# Altium project PCB_Project_2.PrjPcb (part 2 of 4)
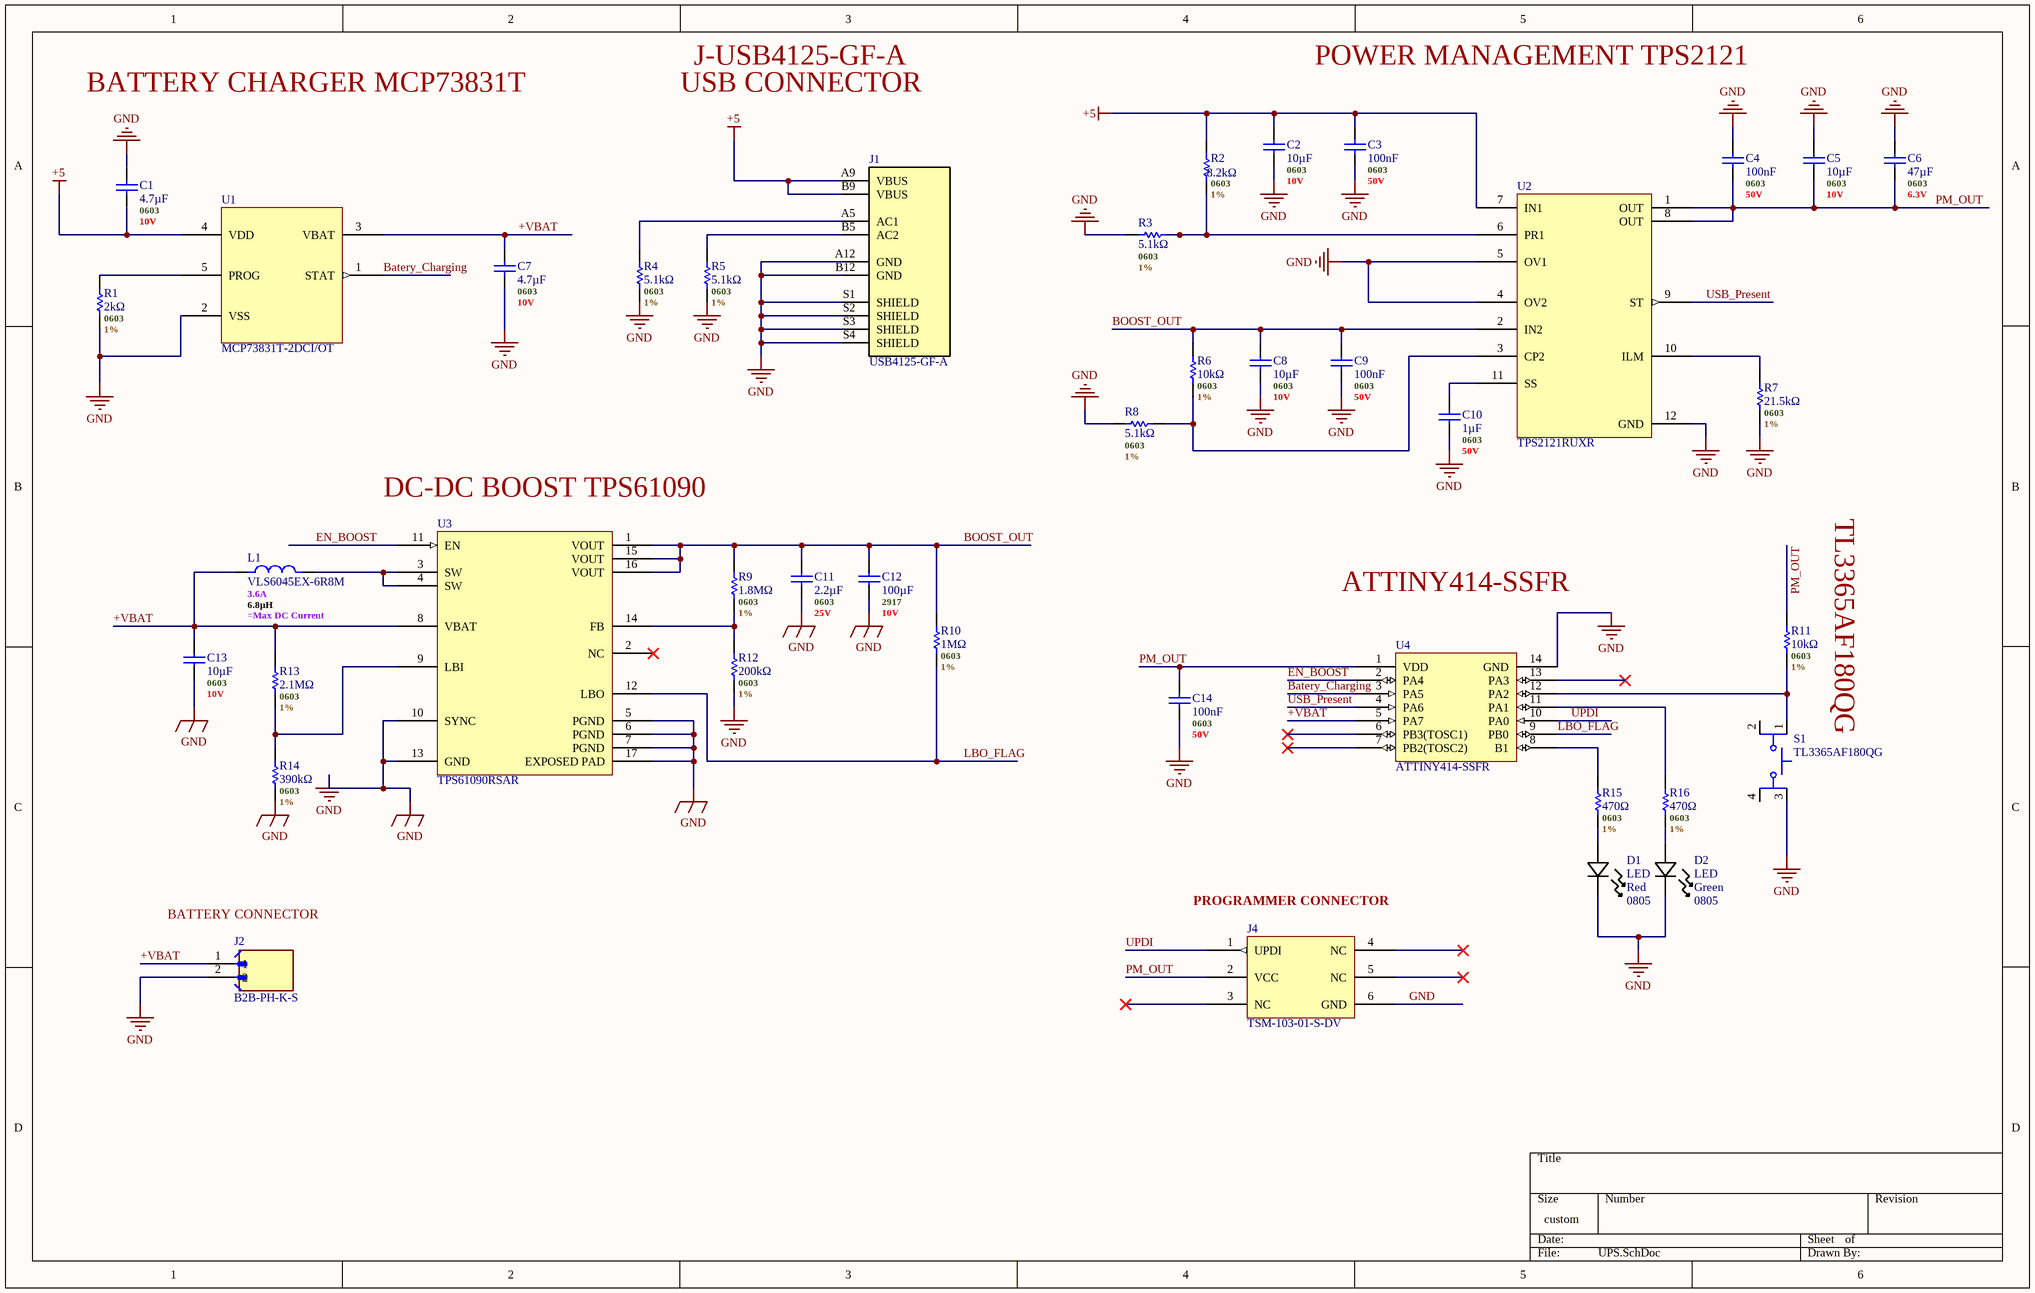
[diagram p1: UPS.SchDoc]

## Sheet UPS.SchDoc (continued)
### Library data of the parts
C1 C7 = CAP - GENERIC: Ceramic Capacitor, Ceramic, 10V, 20% +Tol, 20% -Tol, X7R, 15% TC, 4.7uF, Surface Mount, 0603; Manufacturer: Murata; Manufacturer Part Number: GRM188Z71A475ME15D; Manufacturer Lifecycle Status: IN PRODUCTION; Supplier: DigiKey; Supplier Part Number: 490-GRM188Z71A475ME15DCT-ND; RoHS: Compliant; Category: Ceramic Capacitors; Stock: 107870; Pricing: 1=0,21, 10=0,122, 50=0,0874, 100=0,0768, 500=0,05886, 1000=0,05334 (USD); Value: 4.7µF; Case/Package: 0603; Dielectric Material: Ceramic; Height: 800µm; Length: 1.6mm; Lifecycle Status: Production; Material: Ceramic; Max Operating Temperature: 125°C; Min Operating Temperature: -55°C; Mounting Technology: Surface Mount; Number of Terminals: 2; REACH SVHC: Yes; Thickness: 800µm; Tolerance: 20%; Voltage Rating: 10V; Voltage Rating (DC): 10V; Width: 800µm; ComponentLink1URL: https://datasheet.octopart.com:443/GRM188Z71A475ME15D-Murata-datasheet-149523300.pdf?src-supplier=Newark; ComponentLink1Description: https://datasheet.octopart.com:443/GRM188Z71A475ME15D-Murata-datasheet-149523300.pdf?src-supplier=Newark; ComponentLink2URL: https://datasheet.octopart.com:443/GRM188Z71A475ME15D-Murata-datasheet-141276011.pdf?src-supplier=Geoflip; ComponentLink2Description: https://datasheet.octopart.com:443/GRM188Z71A475ME15D-Murata-datasheet-141276011.pdf?src-supplier=Geoflip; ComponentLink3URL: https://datasheet.octopart.com:443/GRM188Z71A475ME15D-Murata-datasheet-165579666.pdf?src-supplier=TME; ComponentLink3Description: https://datasheet.octopart.com:443/GRM188Z71A475ME15D-Murata-datasheet-165579666.pdf?src-supplier=TME; ComponentLink4URL: https://datasheet.octopart.com:443/GRM188Z71A475ME15D-Murata-datasheet-140705914.pdf?src-supplier=Ciiva; ComponentLink4Description: https://datasheet.octopart.com:443/GRM188Z71A475ME15D-Murata-datasheet-140705914.pdf?src-supplier=Ciiva; ComponentLink5URL: https://datasheet.octopart.com:443/GRM188Z71A475ME15D-Murata-datasheet-138743432.pdf?src-supplier=Ciiva; ComponentLink5Description: https://datasheet.octopart.com:443/GRM188Z71A475ME15D-Murata-datasheet-138743432.pdf?src-supplier=Ciiva; ComponentLink6URL: http://sigma.octopart.com:80/reach_statement/Murata-company-16.pdf?src-supplier=Compliance+Statements; ComponentLink6Description: http://sigma.octopart.com:80/reach_statement/Murata-company-16.pdf?src-supplier=Compliance+Statements; Supplier 1: DigiKey; Supplier Part Number 1: 490-GRM188Z71A475ME15DCT-ND
C2 C5 C8 C13 = CAP - GENERIC: Ceramic Capacitor, Ceramic, 10V, 20% +Tol, 20% -Tol, X5R, 15% TC, 10uF, Surface Mount, 0603; Manufacturer: Murata; Manufacturer Part Number: GRM188R61A106ME69D; Manufacturer Lifecycle Status: IN PRODUCTION; Supplier: DigiKey; Supplier Part Number: 490-10475-1-ND; RoHS: Compliant; Category: Ceramic Capacitors; Stock: 99427; Pricing: 1=0,12, 10=0,067, 50=0,0464, 100=0,0401, 500=0,02974, 1000=0,02654 (USD); Value: 10µF; Case/Package: 0603; Case Code (Imperial): 0603; Case Code (Metric): 1608; Depth: 800µm; Dielectric: X5R; Dielectric Material: Ceramic; Height: 800µm; Lead Free: Lead Free; Length: 1.6mm; Lifecycle Status: Production; Material: Ceramic; Max Operating Temperature: 85°C; Min Operating Temperature: -55°C; Mounting Technology: Surface Mount; Pins: 2; Number of Terminals: 2; REACH SVHC: Yes; Schedule B: 8532240020, 8532240020|8532240020, 8532240020|8532240020|8532240020, 8532240020|8532240020|8532240020|8532240020; Termination: SMD/SMT; Thickness: 800µm; Tolerance: 20%; Voltage Rating: 10V; Voltage Rating (DC): 10V; Weight: 6.293594mg; Width: 800µm; ComponentLink1URL: https://datasheet.octopart.com:443/GRM188R61A106ME69D-Murata-datasheet-32479577.pdf?src-supplier=Upverter; ComponentLink1Description: https://datasheet.octopart.com:443/GRM188R61A106ME69D-Murata-datasheet-32479577.pdf?src-supplier=Upverter; ComponentLink2URL: https://datasheet.octopart.com:443/GRM188R61A106ME69D-Murata-datasheet-34231353.pdf?src-supplier=Newark; ComponentLink2Description: https://datasheet.octopart.com:443/GRM188R61A106ME69D-Murata-datasheet-34231353.pdf?src-supplier=Newark; ComponentLink3URL: https://datasheet.octopart.com:443/GRM188R61A106ME69D-Murata-datasheet-62317187.pdf?src-supplier=element14+APAC; ComponentLink3Description: https://datasheet.octopart.com:443/GRM188R61A106ME69D-Murata-datasheet-62317187.pdf?src-supplier=element14+APAC; ComponentLink4URL: https://datasheet.octopart.com:443/GRM188R61A106ME69D-Murata-datasheet-179080479.pdf?src-supplier=Arrow.cn; ComponentLink4Description: https://datasheet.octopart.com:443/GRM188R61A106ME69D-Murata-datasheet-179080479.pdf?src-supplier=Arrow.cn; ComponentLink5URL: https://datasheet.octopart.com:443/GRM188R61A106ME69D-Murata-datasheet-165579666.pdf?src-supplier=TME; ComponentLink5Description: https://datasheet.octopart.com:443/GRM188R61A106ME69D-Murata-datasheet-165579666.pdf?src-supplier=TME; ComponentLink6URL: https://datasheet.octopart.com:443/GRM188R61A106ME69D-Murata-datasheet-141274968.pdf?src-supplier=Ciiva; ComponentLink6Description: https://datasheet.octopart.com:443/GRM188R61A106ME69D-Murata-datasheet-141274968.pdf?src-supplier=Ciiva; ComponentLink7URL: https://datasheet.octopart.com:443/GRM188R61A106ME69D-Murata-datasheet-140704423.pdf?src-supplier=Ciiva; ComponentLink7Description: https://datasheet.octopart.com:443/GRM188R61A106ME69D-Murata-datasheet-140704423.pdf?src-supplier=Ciiva; ComponentLink8URL: https://datasheet.octopart.com:443/GRM188R61A106ME69D-Murata-datasheet-138742817.pdf?src-supplier=Ciiva; ComponentLink8Description: https://datasheet.octopart.com:443/GRM188R61A106ME69D-Murata-datasheet-138742817.pdf?src-supplier=Ciiva; ComponentLink9URL: https://datasheet.octopart.com:443/GRM188R61A106ME69D-Murata-datasheet-120101189.pdf?src-supplier=Megastar; ComponentLink9Description: https://datasheet.octopart.com:443/GRM188R61A106ME69D-Murata-datasheet-120101189.pdf?src-supplier=Megastar; ComponentLink10URL: https://datasheet.octopart.com:443/GRM188R61A106ME69D-Murata-datasheet-22122223.pdf?src-supplier=Future+Electronics; ComponentLink10Description: https://datasheet.octopart.com:443/GRM188R61A106ME69D-Murata-datasheet-22122223.pdf?src-supplier=Future+Electronics; ComponentLink11URL: https://datasheet.octopart.com/GRM188R61A106ME69D-Murata-datasheet-12515295.pdf; ComponentLink11Description: https://datasheet.octopart.com/GRM188R61A106ME69D-Murata-datasheet-12515295.pdf; ComponentLink12URL: https://datasheet.octopart.com/GRM188R61A106ME69D-Murata-datasheet-12510076.pdf; ComponentLink12Description: https://datasheet.octopart.com/GRM188R61A106ME69D-Murata-datasheet-12510076.pdf; ComponentLink13URL: https://datasheet.octopart.com/GRM188R61A106ME69D-Murata-datasheet-11978611.pdf; ComponentLink13Description: https://datasheet.octopart.com/GRM188R61A106ME69D-Murata-datasheet-11978611.pdf; ComponentLink14URL: https://datasheet.octopart.com/GRM188R61A106ME69D-Murata-datasheet-10025737.pdf; ComponentLink14Description: https://datasheet.octopart.com/GRM188R61A106ME69D-Murata-datasheet-10025737.pdf; ComponentLink15URL: https://datasheet.octopart.com/GRM188R61A106ME69D-Murata-datasheet-8819587.pdf; ComponentLink15Description: https://datasheet.octopart.com/GRM188R61A106ME69D-Murata-datasheet-8819587.pdf; ComponentLink16URL: https://datasheet.octopart.com/GRM188R61A106ME69D-Murata-datasheet-14401046.pdf; ComponentLink16Description: https://datasheet.octopart.com/GRM188R61A106ME69D-Murata-datasheet-14401046.pdf; ComponentLink17URL: http://sigma.octopart.com:80/reach_statement/Murata-company-16.pdf?src-supplier=Compliance+Statements; ComponentLink17Description: http://sigma.octopart.com:80/reach_statement/Murata-company-16.pdf?src-supplier=Compliance+Statements; Supplier 1: DigiKey; Supplier Part Number 1: 490-10475-1-ND
C3 C4 C9 C14 = CAP - GENERIC: Cap Ceramic 0.1uF 50V X7R 10% Pad SMD 0603 Soft Termination 125C Automotive T/R; Manufacturer: Murata; Manufacturer Part Number: GCJ188R71H104KA12D; Manufacturer Lifecycle Status: IN PRODUCTION; Supplier: DigiKey; Supplier Part Number: 490-5798-1-ND; RoHS: Compliant; Category: Ceramic Capacitors; Stock: 2272752; Pricing: 1=0,13, 10=0,072, 50=0,05, 100=0,0434, 500=0,0323, 1000=0,02889 (USD); Value: 100nF; Case/Package: 0603; Case Code (Imperial): 0603; Case Code (Metric): 1608; Depth: 800µm; Dielectric: X7R; Dielectric Material: Ceramic; Features: Soft Termination; Height: 800µm; Lead Free: Lead Free; Length: 1.6mm; Lifecycle Status: Production; Material: Ceramic; Max Operating Temperature: 125°C; Min Operating Temperature: -55°C; Mounting Technology: Surface Mount; Number of Terminals: 2; Packaging: Cut Tape; Radiation Hardening: No; Ratings: AEC-Q200; REACH SVHC: Yes; Schedule B: 8532240020, 8532240020|8532240020, 8532240020|8532240020|8532240020, 8532240020|8532240020|8532240020|8532240020; Termination: SMD/SMT; Tolerance: 10%; Voltage Rating: 50V; Voltage Rating (DC): 50V; Width: 800µm; ComponentLink1URL: https://datasheet.octopart.com:443/GCJ188R71H104KA12D-Murata-datasheet-68586835.pdf?src-supplier=Newark; ComponentLink1Description: https://datasheet.octopart.com:443/GCJ188R71H104KA12D-Murata-datasheet-68586835.pdf?src-supplier=Newark; ComponentLink2URL: https://datasheet.octopart.com:443/GCJ188R71H104KA12D-Murata-datasheet-140654765.pdf?src-supplier=Ciiva; ComponentLink2Description: https://datasheet.octopart.com:443/GCJ188R71H104KA12D-Murata-datasheet-140654765.pdf?src-supplier=Ciiva; ComponentLink3URL: https://datasheet.octopart.com:443/GCJ188R71H104KA12D-Murata-datasheet-138714437.pdf?src-supplier=Ciiva; ComponentLink3Description: https://datasheet.octopart.com:443/GCJ188R71H104KA12D-Murata-datasheet-138714437.pdf?src-supplier=Ciiva; ComponentLink4URL: https://datasheet.octopart.com:443/GCJ188R71H104KA12D-Murata-datasheet-165611796.pdf?src-supplier=TME; ComponentLink4Description: https://datasheet.octopart.com:443/GCJ188R71H104KA12D-Murata-datasheet-165611796.pdf?src-supplier=TME; ComponentLink5URL: https://datasheet.octopart.com:443/GCJ188R71H104KA12D-Murata-datasheet-12524712.pdf?src-supplier=Future+Electronics; ComponentLink5Description: https://datasheet.octopart.com:443/GCJ188R71H104KA12D-Murata-datasheet-12524712.pdf?src-supplier=Future+Electronics; ComponentLink6URL: https://datasheet.octopart.com/GCJ188R71H104KA12D-Murata-datasheet-14405607.pdf; ComponentLink6Description: https://datasheet.octopart.com/GCJ188R71H104KA12D-Murata-datasheet-14405607.pdf; ComponentLink7URL: http://sigma.octopart.com:80/reach_statement/Murata-company-16.pdf?src-supplier=Compliance+Statements; ComponentLink7Description: http://sigma.octopart.com:80/reach_statement/Murata-company-16.pdf?src-supplier=Compliance+Statements; Supplier 1: DigiKey; Supplier Part Number 1: 490-5798-1-ND
C6 = CAP - GENERIC: 6.3V 47uF X5R ±20% 0603 Multilayer Ceramic Capacitors MLCC - SMD/SMT ROHS; Manufacturer: Murata; Manufacturer Part Number: GRM188R60J476ME15D; Manufacturer Lifecycle Status: IN PRODUCTION; Supplier: DigiKey; Supplier Part Number: 490-13247-1-ND; RoHS: Compliant; Category: Ceramic Capacitors; Stock: 2045995; Pricing: 1=0,21, 10=0,11 (USD); Value: 47µF; Case/Package: 0603; Case Code (Imperial): 0603; Case Code (Metric): 1608; Dielectric: X5R; Dielectric Material: Ceramic; Height: 800µm; Length: 1.6mm; Lifecycle Status: Production; Material: Ceramic; Max Operating Temperature: 85°C; Min Operating Temperature: -55°C; Mounting Technology: Surface Mount; Number of Terminals: 2; REACH SVHC: Yes; Schedule B: 8532240020, 8532240020|8532240020|8532240020|8532240020|8532240020|8532240020|8532240020|8532240020|8532240020|8532240020|8532240020|8532240020|8532240020|8532240020|8532240020|8532240020|8532240020|8532240020|8532240020|8532240020|8532240020|8532240020|8532240020|85; Thickness: 800µm; Tolerance: 20%; Voltage Rating: 6.3V; Voltage Rating (DC): 6.3V; Width: 800µm; ComponentLink1URL: https://datasheet.octopart.com:443/GRM188R60J476ME15D-Murata-datasheet-149523200.pdf?src-supplier=Newark; ComponentLink1Description: https://datasheet.octopart.com:443/GRM188R60J476ME15D-Murata-datasheet-149523200.pdf?src-supplier=Newark; ComponentLink2URL: https://datasheet.octopart.com:443/GRM188R60J476ME15D-Murata-datasheet-165579666.pdf?src-supplier=TME; ComponentLink2Description: https://datasheet.octopart.com:443/GRM188R60J476ME15D-Murata-datasheet-165579666.pdf?src-supplier=TME; ComponentLink3URL: https://datasheet.octopart.com:443/GRM188R60J476ME15D-Murata-datasheet-141274968.pdf?src-supplier=Ciiva; ComponentLink3Description: https://datasheet.octopart.com:443/GRM188R60J476ME15D-Murata-datasheet-141274968.pdf?src-supplier=Ciiva; ComponentLink4URL: https://datasheet.octopart.com:443/GRM188R60J476ME15D-Murata-datasheet-140704401.pdf?src-supplier=Ciiva; ComponentLink4Description: https://datasheet.octopart.com:443/GRM188R60J476ME15D-Murata-datasheet-140704401.pdf?src-supplier=Ciiva; ComponentLink5URL: https://datasheet.octopart.com:443/GRM188R60J476ME15D-Murata-datasheet-138742802.pdf?src-supplier=Ciiva; ComponentLink5Description: https://datasheet.octopart.com:443/GRM188R60J476ME15D-Murata-datasheet-138742802.pdf?src-supplier=Ciiva; ComponentLink6URL: https://datasheet.octopart.com:443/GRM188R60J476ME15D-Murata-datasheet-102370999.pdf?src-supplier=Future+Electronics; ComponentLink6Description: https://datasheet.octopart.com:443/GRM188R60J476ME15D-Murata-datasheet-102370999.pdf?src-supplier=Future+Electronics; ComponentLink7URL: https://datasheet.octopart.com/GRM188R60J476ME15D-Murata-datasheet-12515295.pdf; ComponentLink7Description: https://datasheet.octopart.com/GRM188R60J476ME15D-Murata-datasheet-12515295.pdf; ComponentLink8URL: https://datasheet.octopart.com/GRM188R60J476ME15D-Murata-datasheet-12510076.pdf; ComponentLink8Description: https://datasheet.octopart.com/GRM188R60J476ME15D-Murata-datasheet-12510076.pdf; ComponentLink9URL: https://datasheet.octopart.com/GRM188R60J476ME15D-Murata-datasheet-11978611.pdf; ComponentLink9Description: https://datasheet.octopart.com/GRM188R60J476ME15D-Murata-datasheet-11978611.pdf; ComponentLink10URL: https://datasheet.octopart.com/GRM188R60J476ME15D-Murata-datasheet-10025737.pdf; ComponentLink10Description: https://datasheet.octopart.com/GRM188R60J476ME15D-Murata-datasheet-10025737.pdf; ComponentLink11URL: https://datasheet.octopart.com/GRM188R60J476ME15D-Murata-datasheet-8819587.pdf; ComponentLink11Description: https://datasheet.octopart.com/GRM188R60J476ME15D-Murata-datasheet-8819587.pdf; ComponentLink12URL: http://sigma.octopart.com:80/reach_statement/Murata-company-16.pdf?src-supplier=Compliance+Statements; ComponentLink12Description: http://sigma.octopart.com:80/reach_statement/Murata-company-16.pdf?src-supplier=Compliance+Statements; Supplier 1: DigiKey; Supplier Part Number 1: 490-13247-1-ND
C10 = CAP - GENERIC: Multilayer Ceramic Capacitors MLCC - SMD/SMT 0603 50Vdc 1.0uF X5R 10%; Manufacturer: Murata; Manufacturer Part Number: GRT188R61H105KE13D; Manufacturer Lifecycle Status: IN PRODUCTION; Supplier: DigiKey; Supplier Part Number: 490-12330-1-ND; RoHS: Compliant; Category: Ceramic Capacitors; Stock: 586495; Pricing: 1=0,14, 10=0,078, 50=0,0546, 100=0,0475, 500=0,0355, 1000=0,03182 (USD); Value: 1µF; Case/Package: 0603; Case Code (Imperial): 0603; Case Code (Metric): 1608; Dielectric: X5R; Dielectric Material: Ceramic; Height: 800µm; Length: 1.6mm; Lifecycle Status: Production; Material: Ceramic; Max Operating Temperature: 85°C; Min Operating Temperature: -55°C; Mounting Technology: Surface Mount; Number of Terminals: 2; Packaging: Cut Tape; Ratings: AEC-Q200; REACH SVHC: Yes; Schedule B: 8532240020, 8532240020|8532240020, 8532240020|8532240020|8532240020, 8532240020|8532240020|8532240020|8532240020; Tolerance: 10%; Voltage Rating: 50V; Voltage Rating (DC): 50V; Width: 800µm; ComponentLink1URL: https://datasheet.octopart.com:443/GRT188R61H105KE13D-Murata-datasheet-67697751.pdf?src-supplier=Newark; ComponentLink1Description: https://datasheet.octopart.com:443/GRT188R61H105KE13D-Murata-datasheet-67697751.pdf?src-supplier=Newark; ComponentLink2URL: https://datasheet.octopart.com:443/GRT188R61H105KE13D-Murata-datasheet-149523596.pdf?src-supplier=Newark; ComponentLink2Description: https://datasheet.octopart.com:443/GRT188R61H105KE13D-Murata-datasheet-149523596.pdf?src-supplier=Newark; ComponentLink3URL: https://datasheet.octopart.com:443/GRT188R61H105KE13D-Murata-datasheet-141284650.pdf?src-supplier=Geoflip; ComponentLink3Description: https://datasheet.octopart.com:443/GRT188R61H105KE13D-Murata-datasheet-141284650.pdf?src-supplier=Geoflip; ComponentLink4URL: https://datasheet.octopart.com:443/GRT188R61H105KE13D-Murata-datasheet-165579666.pdf?src-supplier=TME; ComponentLink4Description: https://datasheet.octopart.com:443/GRT188R61H105KE13D-Murata-datasheet-165579666.pdf?src-supplier=TME; ComponentLink5URL: https://datasheet.octopart.com:443/GRT188R61H105KE13D-Murata-datasheet-140711328.pdf?src-supplier=Ciiva; ComponentLink5Description: https://datasheet.octopart.com:443/GRT188R61H105KE13D-Murata-datasheet-140711328.pdf?src-supplier=Ciiva; ComponentLink6URL: https://datasheet.octopart.com:443/GRT188R61H105KE13D-Murata-datasheet-138749128.pdf?src-supplier=Ciiva; ComponentLink6Description: https://datasheet.octopart.com:443/GRT188R61H105KE13D-Murata-datasheet-138749128.pdf?src-supplier=Ciiva; ComponentLink7URL: http://sigma.octopart.com:80/reach_statement/Murata-company-16.pdf?src-supplier=Compliance+Statements; ComponentLink7Description: http://sigma.octopart.com:80/reach_statement/Murata-company-16.pdf?src-supplier=Compliance+Statements; Supplier 1: DigiKey; Supplier Part Number 1: 490-12330-1-ND
C11 = CAP - GENERIC: Ceramic Capacitor, Ceramic, 25V, 10% +Tol, 10% -Tol, X5R, 15% TC, 2.2uF, Surface Mount, 0603; Manufacturer: Murata; Manufacturer Part Number: GRM188R61E225KA12D; Manufacturer Lifecycle Status: IN PRODUCTION; Supplier: DigiKey; Supplier Part Number: 490-10731-1-ND; RoHS: Compliant; Category: Ceramic Capacitors; Stock: 188068; Pricing: 1=0,1, 10=0,052, 50=0,0356, 100=0,0307, 500=0,02244, 1000=0,01991 (USD); Value: 2.2µF; Case/Package: 0603; Case Code (Imperial): 0603; Case Code (Metric): 1608; Composition: Ceramic; Depth: 800µm; Dielectric: X5R; Dielectric Material: Ceramic; Height: 800µm; Lead Free: Lead Free; Length: 1.6mm; Lifecycle Status: Production; Material: Ceramic; Max Operating Temperature: 85°C; Min Operating Temperature: -55°C; Mounting Technology: Surface Mount; Pins: 2; Number of Terminals: 2; Packaging: Cut Tape; Radiation Hardening: No; REACH SVHC: Yes; Schedule B: 8532240020, 8532240020|8532240020, 8532240020|8532240020|8532240020, 8532240020|8532240020|8532240020|8532240020; Termination: SMD/SMT; Thickness: 800µm; Tolerance: 10%; Voltage: 25V; Voltage Rating: 25V; Voltage Rating (DC): 25V; Weight: 6.293594mg; Width: 800µm; ComponentLink1URL: https://datasheet.octopart.com:443/GRM188R61E225KA12D-Murata-datasheet-62317198.pdf?src-supplier=element14+APAC; ComponentLink1Description: https://datasheet.octopart.com:443/GRM188R61E225KA12D-Murata-datasheet-62317198.pdf?src-supplier=element14+APAC; ComponentLink2URL: https://datasheet.octopart.com:443/GRM188R61E225KA12D-Murata-datasheet-17853099.pdf?src-supplier=element14+APAC; ComponentLink2Description: https://datasheet.octopart.com:443/GRM188R61E225KA12D-Murata-datasheet-17853099.pdf?src-supplier=element14+APAC; ComponentLink3URL: https://datasheet.octopart.com/GRM188R61E225KA12D-Murata-datasheet-12515295.pdf; ComponentLink3Description: https://datasheet.octopart.com/GRM188R61E225KA12D-Murata-datasheet-12515295.pdf; ComponentLink4URL: https://datasheet.octopart.com/GRM188R61E225KA12D-Murata-datasheet-12510076.pdf; ComponentLink4Description: https://datasheet.octopart.com/GRM188R61E225KA12D-Murata-datasheet-12510076.pdf; ComponentLink5URL: https://datasheet.octopart.com/GRM188R61E225KA12D-Murata-datasheet-11978611.pdf; ComponentLink5Description: https://datasheet.octopart.com/GRM188R61E225KA12D-Murata-datasheet-11978611.pdf; ComponentLink6URL: https://datasheet.octopart.com/GRM188R61E225KA12D-Murata-datasheet-10025737.pdf; ComponentLink6Description: https://datasheet.octopart.com/GRM188R61E225KA12D-Murata-datasheet-10025737.pdf; ComponentLink7URL: https://datasheet.octopart.com/GRM188R61E225KA12D-Murata-datasheet-8819587.pdf; ComponentLink7Description: https://datasheet.octopart.com/GRM188R61E225KA12D-Murata-datasheet-8819587.pdf; ComponentLink8URL: https://datasheet.octopart.com/GRM188R61E225KA12D-Murata-datasheet-14397280.pdf; ComponentLink8Description: https://datasheet.octopart.com/GRM188R61E225KA12D-Murata-datasheet-14397280.pdf; ComponentLink9URL: https://datasheet.octopart.com:443/GRM188R61E225KA12D-Murata-datasheet-165579666.pdf?src-supplier=TME; ComponentLink9Description: https://datasheet.octopart.com:443/GRM188R61E225KA12D-Murata-datasheet-165579666.pdf?src-supplier=TME; ComponentLink10URL: https://datasheet.octopart.com:443/GRM188R61E225KA12D-Murata-datasheet-141274968.pdf?src-supplier=Ciiva; ComponentLink10Description: https://datasheet.octopart.com:443/GRM188R61E225KA12D-Murata-datasheet-141274968.pdf?src-supplier=Ciiva; ComponentLink11URL: https://datasheet.octopart.com:443/GRM188R61E225KA12D-Murata-datasheet-140705128.pdf?src-supplier=Ciiva; ComponentLink11Description: https://datasheet.octopart.com:443/GRM188R61E225KA12D-Murata-datasheet-140705128.pdf?src-supplier=Ciiva; ComponentLink12URL: https://datasheet.octopart.com:443/GRM188R61E225KA12D-Murata-datasheet-138742892.pdf?src-supplier=Ciiva; ComponentLink12Description: https://datasheet.octopart.com:443/GRM188R61E225KA12D-Murata-datasheet-138742892.pdf?src-supplier=Ciiva; ComponentLink13URL: https://datasheet.octopart.com:443/GRM188R61E225KA12D-Murata-datasheet-22122223.pdf?src-supplier=Future+Electronics; ComponentLink13Description: https://datasheet.octopart.com:443/GRM188R61E225KA12D-Murata-datasheet-22122223.pdf?src-supplier=Future+Electronics; ComponentLink14URL: https://datasheet.octopart.com:443/GRM188R61E225KA12D-Murata-datasheet-8817987.pdf?src-supplier=Newark; ComponentLink14Description: https://datasheet.octopart.com:443/GRM188R61E225KA12D-Murata-datasheet-8817987.pdf?src-supplier=Newark; ComponentLink15URL: http://sigma.octopart.com:80/reach_statement/Murata-company-16.pdf?src-supplier=Compliance+Statements; ComponentLink15Description: http://sigma.octopart.com:80/reach_statement/Murata-company-16.pdf?src-supplier=Compliance+Statements; Supplier 1: DigiKey; Supplier Part Number 1: 490-10731-1-ND
C12 = CAP - GENERIC: Cap Tant Solid 100uF 10V D CASE 20% (7.3 X 4.3 X 2.9mm) SMD 7343-31 0.08 Ohm 125AHA T/R; Manufacturer: KYOCERA AVX; Manufacturer Part Number: TPSD107M010R0080; Approvals: IEC; Dielectric Material: Tantalum; Dissipation Factor: 6%; ESR (Equivalent Series Resistance): 80mΩ; Leakage Current: 10µA; Polarity: Polar; Ripple Current: 548mA; Supplier: DigiKey; Supplier Part Number: 478-4097-1-ND; RoHS: Compliant; Category: Tantalum Capacitors; Stock: 1449; Pricing: 1=1,63, 10=1,083, 50=0,8666, 100=0,7998 (USD); Value: 100µF; Case/Package: 2917; Case Code (Imperial): 2917; Case Code (Metric): 7343; China RoHS: Compliant; Depth: 4.3mm; Features: General Purpose; Height: 2.9mm; Height - Seated (Max): 3.0988mm; Lead Free: Lead Free; Lead Pitch: 4.4mm; Length: 7.3mm; Lifecycle Status: Production; Max Operating Temperature: 125°C; Min Operating Temperature: -55°C; Mounting Technology: Surface Mount; Pins: 2; Number of Terminals: 2; Radiation Hardening: No; REACH SVHC: Yes; Schedule B: 8532210050; Termination: SMD/SMT; Tolerance: 20%; Voltage: 10V; Voltage Rating: 10V; Voltage Rating (DC): 10V; Width: 4.3mm; ComponentLink1URL: https://datasheet.octopart.com:443/TPSD107M010R0080-KYOCERA-AVX-datasheet-170667337.pdf?src-supplier=IHS; ComponentLink1Description: https://datasheet.octopart.com:443/TPSD107M010R0080-KYOCERA-AVX-datasheet-170667337.pdf?src-supplier=IHS; ComponentLink2URL: https://datasheet.octopart.com:443/TPSD107M010R0080-AVX-datasheet-12510848.pdf?src-supplier=Newark; ComponentLink2Description: https://datasheet.octopart.com:443/TPSD107M010R0080-AVX-datasheet-12510848.pdf?src-supplier=Newark; ComponentLink3URL: https://datasheet.octopart.com:443/TPSD107M010R0080-AVX-datasheet-8360139.pdf?src-supplier=Newark; ComponentLink3Description: https://datasheet.octopart.com:443/TPSD107M010R0080-AVX-datasheet-8360139.pdf?src-supplier=Newark; ComponentLink4URL: https://datasheet.octopart.com:443/TPSD107M010R0080-AVX-datasheet-8324186.pdf?src-supplier=Newark; ComponentLink4Description: https://datasheet.octopart.com:443/TPSD107M010R0080-AVX-datasheet-8324186.pdf?src-supplier=Newark; ComponentLink5URL: https://datasheet.octopart.com:443/TPSD107M010R0080-AVX-datasheet-27202918.pdf?src-supplier=Newark; ComponentLink5Description: https://datasheet.octopart.com:443/TPSD107M010R0080-AVX-datasheet-27202918.pdf?src-supplier=Newark; ComponentLink6URL: https://datasheet.octopart.com:443/TPSD107M010R0080-AVX-datasheet-10076061.pdf?src-supplier=Future+Electronics; ComponentLink6Description: https://datasheet.octopart.com:443/TPSD107M010R0080-AVX-datasheet-10076061.pdf?src-supplier=Future+Electronics; ComponentLink7URL: https://datasheet.octopart.com:443/TPSD107M010R0080-AVX-datasheet-10290340.pdf?src-supplier=Future+Electronics; ComponentLink7Description: https://datasheet.octopart.com:443/TPSD107M010R0080-AVX-datasheet-10290340.pdf?src-supplier=Future+Electronics; ComponentLink8URL: https://datasheet.octopart.com:443/TPSD107M010R0080-AVX-datasheet-8878329.pdf?src-supplier=Future+Electronics; ComponentLink8Description: https://datasheet.octopart.com:443/TPSD107M010R0080-AVX-datasheet-8878329.pdf?src-supplier=Future+Electronics; ComponentLink9URL: https://datasheet.octopart.com:443/TPSD107M010R0080-AVX-datasheet-8858609.pdf?src-supplier=Future+Electronics; ComponentLink9Description: https://datasheet.octopart.com:443/TPSD107M010R0080-AVX-datasheet-8858609.pdf?src-supplier=Future+Electronics; ComponentLink10URL: https://datasheet.octopart.com:443/TPSD107M010R0080-AVX-datasheet-8837929.pdf?src-supplier=Future+Electronics; ComponentLink10Description: https://datasheet.octopart.com:443/TPSD107M010R0080-AVX-datasheet-8837929.pdf?src-supplier=Future+Electronics; ComponentLink11URL: https://datasheet.octopart.com:443/TPSD107M010R0080-AVX-datasheet-8725229.pdf?src-supplier=Future+Electronics; ComponentLink11Description: https://datasheet.octopart.com:443/TPSD107M010R0080-AVX-datasheet-8725229.pdf?src-supplier=Future+Electronics; ComponentLink12URL: https://datasheet.octopart.com:443/TPSD107M010R0080-AVX-datasheet-8700837.pdf?src-supplier=Future+Electronics; ComponentLink12Description: https://datasheet.octopart.com:443/TPSD107M010R0080-AVX-datasheet-8700837.pdf?src-supplier=Future+Electronics; ComponentLink13URL: https://datasheet.octopart.com:443/TPSD107M010R0080-AVX-datasheet-8619349.pdf?src-supplier=Future+Electronics; ComponentLink13Description: https://datasheet.octopart.com:443/TPSD107M010R0080-AVX-datasheet-8619349.pdf?src-supplier=Future+Electronics; ComponentLink14URL: https://datasheet.octopart.com:443/TPSD107M010R0080-AVX-datasheet-8446044.pdf?src-supplier=Future+Electronics; ComponentLink14Description: https://datasheet.octopart.com:443/TPSD107M010R0080-AVX-datasheet-8446044.pdf?src-supplier=Future+Electronics; ComponentLink15URL: https://datasheet.octopart.com:443/TPSD107M010R0080-AVX-datasheet-7831437.pdf?src-supplier=Future+Electronics; ComponentLink15Description: https://datasheet.octopart.com:443/TPSD107M010R0080-AVX-datasheet-7831437.pdf?src-supplier=Future+Electronics; ComponentLink16URL: https://datasheet.octopart.com:443/TPSD107M010R0080-AVX-datasheet-7558262.pdf?src-supplier=Future+Electronics; ComponentLink16Description: https://datasheet.octopart.com:443/TPSD107M010R0080-AVX-datasheet-7558262.pdf?src-supplier=Future+Electronics; ComponentLink17URL: https://datasheet.octopart.com:443/TPSD107M010R0080-AVX-datasheet-5394076.pdf?src-supplier=Future+Electronics; ComponentLink17Description: https://datasheet.octopart.com:443/TPSD107M010R0080-AVX-datasheet-5394076.pdf?src-supplier=Future+Electronics; ComponentLink18URL: https://datasheet.octopart.com:443/TPSD107M010R0080-AVX-datasheet-5306713.pdf?src-supplier=Future+Electronics; ComponentLink18Description: https://datasheet.octopart.com:443/TPSD107M010R0080-AVX-datasheet-5306713.pdf?src-supplier=Future+Electronics; ComponentLink19URL: https://datasheet.octopart.com:443/TPSD107M010R0080-AVX-datasheet-554398.pdf?src-supplier=Future+Electronics; ComponentLink19Description: https://datasheet.octopart.com:443/TPSD107M010R0080-AVX-datasheet-554398.pdf?src-supplier=Future+Electronics; ComponentLink20URL: https://datasheet.octopart.com:443/TPSD107M010R0080-KYOCERA-AVX-datasheet-103254538.pdf?src-supplier=element14+APAC; ComponentLink20Description: https://datasheet.octopart.com:443/TPSD107M010R0080-KYOCERA-AVX-datasheet-103254538.pdf?src-supplier=element14+APAC; ComponentLink21URL: https://datasheet.octopart.com:443/TPSD107M010R0080-AVX-datasheet-65931755.pdf?src-supplier=Farnell; ComponentLink21Description: https://datasheet.octopart.com:443/TPSD107M010R0080-AVX-datasheet-65931755.pdf?src-supplier=Farnell; ComponentLink22URL: https://datasheet.octopart.com:443/TPSD107M010R0080-KYOCERA-AVX-datasheet-50869160.pdf?src-supplier=AVX; ComponentLink22Description: https://datasheet.octopart.com:443/TPSD107M010R0080-KYOCERA-AVX-datasheet-50869160.pdf?src-supplier=AVX; ComponentLink23URL: https://datasheet.octopart.com:443/TPSD107M010R0080-KYOCERA-AVX-datasheet-156093879.pdf?src-supplier=TME; ComponentLink23Description: https://datasheet.octopart.com:443/TPSD107M010R0080-KYOCERA-AVX-datasheet-156093879.pdf?src-supplier=TME; ComponentLink24URL: https://datasheet.octopart.com/TPS-Series---Standard-Tantalum-AVX-datasheet-family-190.pdf; ComponentLink24Description: https://datasheet.octopart.com/TPS-Series---Standard-Tantalum-AVX-datasheet-family-190.pdf; ComponentLink25URL: https://datasheet.octopart.com/TPSD107M010R0080-AVX---Kyocera-datasheet-12511273.pdf; ComponentLink25Description: https://datasheet.octopart.com/TPSD107M010R0080-AVX---Kyocera-datasheet-12511273.pdf; ComponentLink26URL: https://datasheet.octopart.com/TPSD107M010R0080-AVX---Kyocera-datasheet-8398506.pdf; ComponentLink26Description: https://datasheet.octopart.com/TPSD107M010R0080-AVX---Kyocera-datasheet-8398506.pdf; ComponentLink27URL: https://datasheet.octopart.com/TPSD107M010R0080-AVX---Kyocera-datasheet-8359467.pdf; ComponentLink27Description: https://datasheet.octopart.com/TPSD107M010R0080-AVX---Kyocera-datasheet-8359467.pdf; ComponentLink28URL: https://datasheet.octopart.com:443/TPSD107M010R0080-AVX-datasheet-37470795.pdf?src-supplier=RS+(Formerly+Allied+Electronics); ComponentLink28Description: https://datasheet.octopart.com:443/TPSD107M010R0080-AVX-datasheet-37470795.pdf?src-supplier=RS+(Formerly+Allied+Electronics); ComponentLink29URL: https://datasheet.octopart.com:443/TPSD107M010R0080-AVX-datasheet-10394.pdf?src-supplier=RS+(Formerly+Allied+Electronics); ComponentLink29Description: https://datasheet.octopart.com:443/TPSD107M010R0080-AVX-datasheet-10394.pdf?src-supplier=RS+(Formerly+Allied+Electronics); ComponentLink30URL: https://datasheet.octopart.com:443/TPSD107M010R0080-AVX-datasheet-30272.pdf?src-supplier=RS+(Formerly+Allied+Electronics); ComponentLink30Description: https://datasheet.octopart.com:443/TPSD107M010R0080-AVX-datasheet-30272.pdf?src-supplier=RS+(Formerly+Allied+Electronics); ComponentLink31URL: https://datasheet.octopart.com:443/TPSD107M010R0080-AVX-datasheet-13379207.pdf?src-supplier=_legacy+Avnet; ComponentLink31Description: https://datasheet.octopart.com:443/TPSD107M010R0080-AVX-datasheet-13379207.pdf?src-supplier=_legacy+Avnet; ComponentLink32URL: https://datasheet.octopart.com:443/TPSD107M010R0080-AVX-datasheet-8398416.pdf?src-supplier=_legacy+Avnet; ComponentLink32Description: https://datasheet.octopart.com:443/TPSD107M010R0080-AVX-datasheet-8398416.pdf?src-supplier=_legacy+Avnet; ComponentLink33URL: https://datasheet.octopart.com:443/TPSD107M010R0080-AVX-datasheet-8372916.pdf?src-supplier=_legacy+Avnet; ComponentLink33Description: https://datasheet.octopart.com:443/TPSD107M010R0080-AVX-datasheet-8372916.pdf?src-supplier=_legacy+Avnet; ComponentLink34URL: https://datasheet.octopart.com:443/TPSD107M010R0080-AVX-datasheet-5333682.pdf?src-supplier=_legacy+Avnet; ComponentLink34Description: https://datasheet.octopart.com:443/TPSD107M010R0080-AVX-datasheet-5333682.pdf?src-supplier=_legacy+Avnet; ComponentLink35URL: https://datasheet.octopart.com:443/TPSD107M010R0080-AVX-datasheet-11541637.pdf?src-supplier=Arrow+Electronics; ComponentLink35Description: https://datasheet.octopart.com:443/TPSD107M010R0080-AVX-datasheet-11541637.pdf?src-supplier=Arrow+Electronics; ComponentLink36URL: https://datasheet.octopart.com:443/TPSD107M010R0080-AVX-datasheet-118643.pdf?src-supplier=DigiKey; ComponentLink36Description: https://datasheet.octopart.com:443/TPSD107M010R0080-AVX-datasheet-118643.pdf?src-supplier=DigiKey; ComponentLink37URL: http://sigma.octopart.com:80/reach_statement/AVX-company-19.pdf?src-supplier=Compliance+Statements; ComponentLink37Description: http://sigma.octopart.com:80/reach_statement/AVX-company-19.pdf?src-supplier=Compliance+Statements; ComponentLink38URL: http://sigma.octopart.com:80/conflict_mineral_statement/AVX-company-34.pdf?src-supplier=Compliance+Statements; ComponentLink38Description: http://sigma.octopart.com:80/conflict_mineral_statement/AVX-company-34.pdf?src-supplier=Compliance+Statements; Supplier 1: DigiKey; Supplier Part Number 1: 478-4097-1-ND
D1 = LED: Single-color LEDs; LITEON; LTST-C170KRKT; Red; 130 °; 2 V; 0805; Manufacturer: Lite-On; Dominant Wavelength: 631nm; Forward Current: 30mA; Forward Voltage: 2.4V; Lens Color: Clear, Colorless; Lens Style: Clear; Luminous Intensity: 18mcd; Number of Circuits: 1; Peak Wavelength: 639nm; Power Dissipation: 75mW; Reverse Voltage: 5V; Shape: Rectangular; Test Current: 20mA; Viewing Angle: 130°; Supplier: DigiKey; Supplier Part Number: 160-1415-1-ND; Manufacturer Part Number: LTST-C170KRKT; RoHS: Compliant; Category: LEDs; Stock: 400623; Pricing: 1=0,16, 10=0,111, 100=0,0769, 500=0,0611, 1000=0,05583 (USD); Case/Package: 0805; Case Code (Imperial): 0805; Case Code (Metric): 2012; China RoHS: Compliant; Color: Red; Depth: 1.6mm; Height: 1.1mm; Illumination Color: Red; Lead Free: Lead Free; Length: 3.2mm; Lens Transparency: Clear; Lifecycle Status: Production; Max Operating Temperature: 85°C; Min Operating Temperature: -55°C; Mounting Technology: Surface Mount; Number of Elements: 1; Number of LEDs: 1; Pins: 2; Number of Terminals: 2; Packaging: Cut Tape; Power Rating: 75mW; Radiation Hardening: No; REACH SVHC: Yes; Schedule B: 8541402000, 8541402000|8541402000|8541402000|8541402000|8541402000; Terminal Pitch: 2.1mm; Wavelength: 631nm; Width: 1.25mm; ComponentLink1URL: https://datasheet.octopart.com:443/LTST-C170KRKT-Lite-On-datasheet-26684674.pdf?src-supplier=Upverter; ComponentLink1Description: https://datasheet.octopart.com:443/LTST-C170KRKT-Lite-On-datasheet-26684674.pdf?src-supplier=Upverter; ComponentLink2URL: https://datasheet.octopart.com:443/LTST-C170KRKT-Lite-On-datasheet-180605146.pdf?src-supplier=IHS; ComponentLink2Description: https://datasheet.octopart.com:443/LTST-C170KRKT-Lite-On-datasheet-180605146.pdf?src-supplier=IHS; ComponentLink3URL: https://datasheet.octopart.com:443/LTST-C170KRKT-Lite-On-datasheet-158436.pdf?src-supplier=_legacy+Avnet; ComponentLink3Description: https://datasheet.octopart.com:443/LTST-C170KRKT-Lite-On-datasheet-158436.pdf?src-supplier=_legacy+Avnet; ComponentLink4URL: https://datasheet.octopart.com:443/LTST-C170KRKT-Lite-On-datasheet-157246157.pdf?src-supplier=ODG+(Origin+Data+Global); ComponentLink4Description: https://datasheet.octopart.com:443/LTST-C170KRKT-Lite-On-datasheet-157246157.pdf?src-supplier=ODG+(Origin+Data+Global); ComponentLink5URL: https://datasheet.octopart.com:443/LTST-C170KRKT-Lite-On-datasheet-166322636.pdf?src-supplier=TME; ComponentLink5Description: https://datasheet.octopart.com:443/LTST-C170KRKT-Lite-On-datasheet-166322636.pdf?src-supplier=TME; ComponentLink6URL: https://datasheet.octopart.com:443/LTST-C170KRKT-Lite-On-datasheet-165573808.pdf?src-supplier=TME; ComponentLink6Description: https://datasheet.octopart.com:443/LTST-C170KRKT-Lite-On-datasheet-165573808.pdf?src-supplier=TME; ComponentLink7URL: https://datasheet.octopart.com:443/LTST-C170KRKT-Lite-On-datasheet-8325281.pdf?src-supplier=Future+Electronics; ComponentLink7Description: https://datasheet.octopart.com:443/LTST-C170KRKT-Lite-On-datasheet-8325281.pdf?src-supplier=Future+Electronics; ComponentLink8URL: https://datasheet.octopart.com:443/LTST-C170KRKT-Lite-On-datasheet-94966.pdf?src-supplier=DigiKey; ComponentLink8Description: https://datasheet.octopart.com:443/LTST-C170KRKT-Lite-On-datasheet-94966.pdf?src-supplier=DigiKey; Supplier 1: DigiKey; Supplier Part Number 1: 160-1415-1-ND
D2 = LED: Single-color LEDs; LITEON; LTST-C170GKT; Green; 130 °; 2.1 V; 0805; Manufacturer: Lite-On; Current: 4A; Dominant Wavelength: 569nm; Forward Current: 30mA; Forward Voltage: 2.6V; Lens Color: Clear, Colorless; Lens Transparency: Clear; Luminous Intensity: 6mcd; Number of Circuits: 1; Peak Wavelength: 565nm; Power Dissipation: 100mW; Reverse Voltage: 5V; Shape: Rectangular; Test Current: 10mA; Viewing Angle: 130°; Supplier: DigiKey; Supplier Part Number: 160-1179-1-ND; Manufacturer Part Number: LTST-C170GKT; RoHS: Compliant; Category: LEDs; Stock: 1097965; Pricing: 1=0,1, 10=0,066, 100=0,0453, 500=0,03552, 1000=0,03224 (USD); Case/Package: 0805; Case Code (Imperial): 0805; Case Code (Metric): 2012; China RoHS: Compliant; Color: Green; Depth: 1.25mm; Height: 1.1mm; Illumination Color: Green; Lead Free: Lead Free; Length: 2mm; Lifecycle Status: Production; Max Operating Temperature: 85°C; Min Operating Temperature: -55°C; Mounting Technology: Surface Mount; Number of Elements: 1; Number of LEDs: 1; Pins: 2; Number of Terminals: 2; Packaging: Tape and Reel; Power Rating: 100mW; Radiation Hardening: No; REACH SVHC: Yes; Schedule B: 8541402000, 8541402000|8541402000|8541402000|8541402000|8541402000|8541402000|8541402000|8541402000|8541402000|8541402000|8541402000|8541402000|8541402000|8541402000|8541402000|8541402000|8541402000|8541402000|8541402000|8541402000|8541402000|8541402000|8541402000|85; Terminal Pitch: 2.1mm; Voltage: 5V; Wavelength: 569nm; Width: 1.25mm; ComponentLink1URL: https://datasheet.octopart.com:443/LTST-C170GKT-Lite-On-datasheet-180605137.pdf?src-supplier=IHS; ComponentLink1Description: https://datasheet.octopart.com:443/LTST-C170GKT-Lite-On-datasheet-180605137.pdf?src-supplier=IHS; ComponentLink2URL: https://datasheet.octopart.com:443/LTST-C170GKT-Lite-On-datasheet-141439001.pdf?src-supplier=Upverter; ComponentLink2Description: https://datasheet.octopart.com:443/LTST-C170GKT-Lite-On-datasheet-141439001.pdf?src-supplier=Upverter; ComponentLink3URL: https://datasheet.octopart.com:443/LTST-C170GKT-Lite-On-datasheet-159307.pdf?src-supplier=Arrow+Electronics; ComponentLink3Description: https://datasheet.octopart.com:443/LTST-C170GKT-Lite-On-datasheet-159307.pdf?src-supplier=Arrow+Electronics; ComponentLink4URL: https://datasheet.octopart.com:443/LTST-C170GKT-Lite-On-datasheet-8330158.pdf?src-supplier=TME; ComponentLink4Description: https://datasheet.octopart.com:443/LTST-C170GKT-Lite-On-datasheet-8330158.pdf?src-supplier=TME; ComponentLink5URL: https://datasheet.octopart.com:443/LTST-C170GKT-Lite-On-datasheet-26684672.pdf?src-supplier=Future+Electronics; ComponentLink5Description: https://datasheet.octopart.com:443/LTST-C170GKT-Lite-On-datasheet-26684672.pdf?src-supplier=Future+Electronics; ComponentLink6URL: https://datasheet.octopart.com:443/LTST-C170GKT-Lite-On-datasheet-59241.pdf?src-supplier=DigiKey; ComponentLink6Description: https://datasheet.octopart.com:443/LTST-C170GKT-Lite-On-datasheet-59241.pdf?src-supplier=DigiKey; ComponentLink7URL: https://datasheet.octopart.com:443/LTST-C170GKT-Lite-On-datasheet-14174986.pdf?src-supplier=iiiC; ComponentLink7Description: https://datasheet.octopart.com:443/LTST-C170GKT-Lite-On-datasheet-14174986.pdf?src-supplier=iiiC; Supplier 1: DigiKey; Supplier Part Number 1: 160-1179-1-ND
J1 = USB4125-GF-A: USB Connector, 6 Contact(s), Male, Right Angle, Surface Mount Terminal, Locking, Receptacle; Manufacturer: Global Connector Technology; MP: USB4125-GF-A_REVA2; Contact Resistance: 50mΩ; Current Rating: 4.25A; Dielectric Material: Liquid Crystal Polymer; Insulation Resistance: 100MΩ; Number of Ports: 1; Package: None; Availability: Unavailable; Value: *; Price: None; Supplier: DigiKey; Supplier Part Number: 2073-USB4125-GF-ACT-ND; Manufacturer Part Number: USB4125-GF-A; RoHS: Compliant; Category: USB Connectors; Stock: 22186; Pricing: 1=0,59, 10=0,505, 25=0,4736, 50=0,451, 100=0,4293, 250=0,4024, 500=0,38318 (USD); China RoHS: Compliant; Contact Gender: Male; Gender: Receptacle; Lifecycle Status: Production; Max Operating Temperature: 85°C; Min Operating Temperature: -30°C; Pins: 6; Number of Rows: 1; Orientation: Horizontal; REACH SVHC: Yes; Shell Finish: Nickel; Shell Material: Stainless Steel; Terminal Pitch: 1mm; ComponentLink1URL: https://datasheet.octopart.com:443/USB4125-GF-A-Global-Connector-Technology-datasheet-166929326.pdf?src-supplier=SOS+electronic; ComponentLink1Description: https://datasheet.octopart.com:443/USB4125-GF-A-Global-Connector-Technology-datasheet-166929326.pdf?src-supplier=SOS+electronic; ComponentLink2URL: https://datasheet.octopart.com:443/USB4125-GF-A-GCT-datasheet-188869080.pdf?src-supplier=TME; ComponentLink2Description: https://datasheet.octopart.com:443/USB4125-GF-A-GCT-datasheet-188869080.pdf?src-supplier=TME; ComponentLink3URL: https://datasheet.octopart.com:443/USB4125-GF-A-GCT-datasheet-188869081.pdf?src-supplier=TME; ComponentLink3Description: https://datasheet.octopart.com:443/USB4125-GF-A-GCT-datasheet-188869081.pdf?src-supplier=TME; ComponentLink4URL: https://datasheet.octopart.com:443/USB4125-GF-A-GCT-datasheet-166929327.pdf?src-supplier=TME; ComponentLink4Description: https://datasheet.octopart.com:443/USB4125-GF-A-GCT-datasheet-166929327.pdf?src-supplier=TME; ComponentLink5URL: https://datasheet.octopart.com:443/USB4125-GF-A-Global-Connector-Technology-datasheet-148864632.pdf?src-supplier=Future+Electronics; ComponentLink5Description: https://datasheet.octopart.com:443/USB4125-GF-A-Global-Connector-Technology-datasheet-148864632.pdf?src-supplier=Future+Electronics; Supplier 1: DigiKey; Supplier Part Number 1: 2073-USB4125-GF-ACT-ND
J2 = B2B-PH-K-S: Connector Header, PH Series, 2 Position, 2.00mm, Through Hole, Press-Fit, Solder, Natural; Manufacturer: JST; Manufacturer Part Number: B2B-PH-K-S(LF)(SN); MF: JST Sales America Inc.; Connector Type: Male Pin; Contact Resistance: 20mΩ; Current Rating: 2A; Gender: Female; Insulation Resistance: 1GΩ; Max Voltage Rating (AC): 100V; Number of Contacts: 2; Pitch: 2mm; SnapEDA_Link: https://www.snapeda.com/parts/B2B-PH-K-S/JST/view-part/?ref=snap; Package: None; Value: *; MP: B2B-PH-K-S; Check_prices: https://www.snapeda.com/parts/B2B-PH-K-S/JST/view-part/?ref=eda; Supplier: Mouser; Supplier Part Number: 306-B2BPHKSLFSNPP; RoHS: Compliant; Category: Headers and Wire Housings; Stock: 3729; Pricing: 1=0,1, 10=0,083, 50=0,083, 100=0,071, 1000=0,059, 10000=0,05 (USD); China RoHS: Compliant; Contact Gender: Male; Contact Material: Brass; Contact Mating Length: 3.302mm; Contact Plating: Tin; Depth: 4.5mm; Fastening Type: Detent; Height: 6mm; Housing Color: Natural; Housing Material: Nylon; Lead Free: Lead Free; Lead Pitch: 2mm; Length: 5.9mm; Lifecycle Status: Production; Max Current Rating: 2A; Max Operating Temperature: 85°C; Max Voltage Rating (DC): 100V; Min Operating Temperature: -25°C; Mounting Technology: Through Hole; Pins: 2; Number of Poles: 2; Number of Positions: 2; Number of Rows: 1; Orientation: Straight; Packaging: Bulk; REACH SVHC: Yes; Schedule B: 8536694040; Terminal Pitch: 2mm; Termination: Solder; Voltage Rating: 100V; Voltage Rating (AC): 100V; Voltage Rating (DC): 100V; Weight: 28.349523g; Width: 4.5mm; Working Voltage: 100V; ComponentLink1URL: https://datasheet.octopart.com:443/B2B-PH-K-S%28LF%29%28SN%29-JST-datasheet-180491669.pdf?src-supplier=IHS; ComponentLink1Description: https://datasheet.octopart.com:443/B2B-PH-K-S%28LF%29%28SN%29-JST-datasheet-180491669.pdf?src-supplier=IHS; ComponentLink2URL: https://datasheet.octopart.com:443/B2B-PH-K-S%28LF%29%28SN%29-JST-datasheet-10411123.pdf?src-supplier=Upverter; ComponentLink2Description: https://datasheet.octopart.com:443/B2B-PH-K-S%28LF%29%28SN%29-JST-datasheet-10411123.pdf?src-supplier=Upverter; ComponentLink3URL: https://datasheet.octopart.com:443/B2B-PH-K-S%28LF%29%28SN%29-JST-datasheet-8324864.pdf?src-supplier=Upverter; ComponentLink3Description: https://datasheet.octopart.com:443/B2B-PH-K-S%28LF%29%28SN%29-JST-datasheet-8324864.pdf?src-supplier=Upverter; ComponentLink4URL: https://datasheet.octopart.com:443/B2B-PH-K-S%28LF%29%28SN%29-JST-datasheet-62336358.pdf?src-supplier=element14+APAC; ComponentLink4Description: https://datasheet.octopart.com:443/B2B-PH-K-S%28LF%29%28SN%29-JST-datasheet-62336358.pdf?src-supplier=element14+APAC; ComponentLink5URL: https://datasheet.octopart.com:443/B2B-PH-K-S%28LF%29%28SN%29-JST-datasheet-520811.pdf?src-supplier=element14+APAC; ComponentLink5Description: https://datasheet.octopart.com:443/B2B-PH-K-S%28LF%29%28SN%29-JST-datasheet-520811.pdf?src-supplier=element14+APAC; ComponentLink6URL: https://datasheet.octopart.com:443/B2B-PH-K-S%28LF%29%28SN%29-JST-datasheet-15068535.pdf?src-supplier=SOS+electronic; ComponentLink6Description: https://datasheet.octopart.com:443/B2B-PH-K-S%28LF%29%28SN%29-JST-datasheet-15068535.pdf?src-supplier=SOS+electronic; ComponentLink7URL: https://datasheet.octopart.com:443/B2B-PH-K-S%28LF%29%28SN%29-JST-datasheet-147762421.pdf?src-supplier=LKR; ComponentLink7Description: https://datasheet.octopart.com:443/B2B-PH-K-S%28LF%29%28SN%29-JST-datasheet-147762421.pdf?src-supplier=LKR; ComponentLink8URL: https://datasheet.octopart.com:443/B2B-PH-K-S%28LF%29%28SN%29-JST-datasheet-12510261.pdf?src-supplier=Future+Electronics; ComponentLink8Description: https://datasheet.octopart.com:443/B2B-PH-K-S%28LF%29%28SN%29-JST-datasheet-12510261.pdf?src-supplier=Future+Electronics; ComponentLink9URL: https://datasheet.octopart.com:443/B2B-PH-K-S%28LF%29%28SN%29-JST-datasheet-56537.pdf?src-supplier=Future+Electronics; ComponentLink9Description: https://datasheet.octopart.com:443/B2B-PH-K-S%28LF%29%28SN%29-JST-datasheet-56537.pdf?src-supplier=Future+Electronics; ComponentLink10URL: https://datasheet.octopart.com:443/B2B-PH-K-S%28LF%29%28SN%29-JST-datasheet-159515011.pdf?src-supplier=Amar+Radio+Corporation; ComponentLink10Description: https://datasheet.octopart.com:443/B2B-PH-K-S%28LF%29%28SN%29-JST-datasheet-159515011.pdf?src-supplier=Amar+Radio+Corporation; Supplier 1: Mouser; Supplier Part Number 1: 306-B2BPHKSLFSNPP